# Altium schematic sheet Project_Overview.SchDoc: Project overview
size A4; Date: Not used; ApprovedBy: Not used; CheckedBy: Not used; Author: Not used; CompanyName: STMicroelectronics; DrawnBy: Not used; Engineer: Not used; Organization: Not used; Address1: Not used; Address2: Not used; Address3: Not used; Address4: Not used; DocumentNumber: MB1166; Revision: Not used; SheetNumber: 1; SheetTotal: 16; CurrentTime: Not used; CurrentDate: Not used; Time: Not used; DocumentFullPathAndName: Not used; DocumentName: Not used; ModifiedDate: Not used; ImagePath: Not used; ProjectName: Not used; Application_BuildNumber: Not used
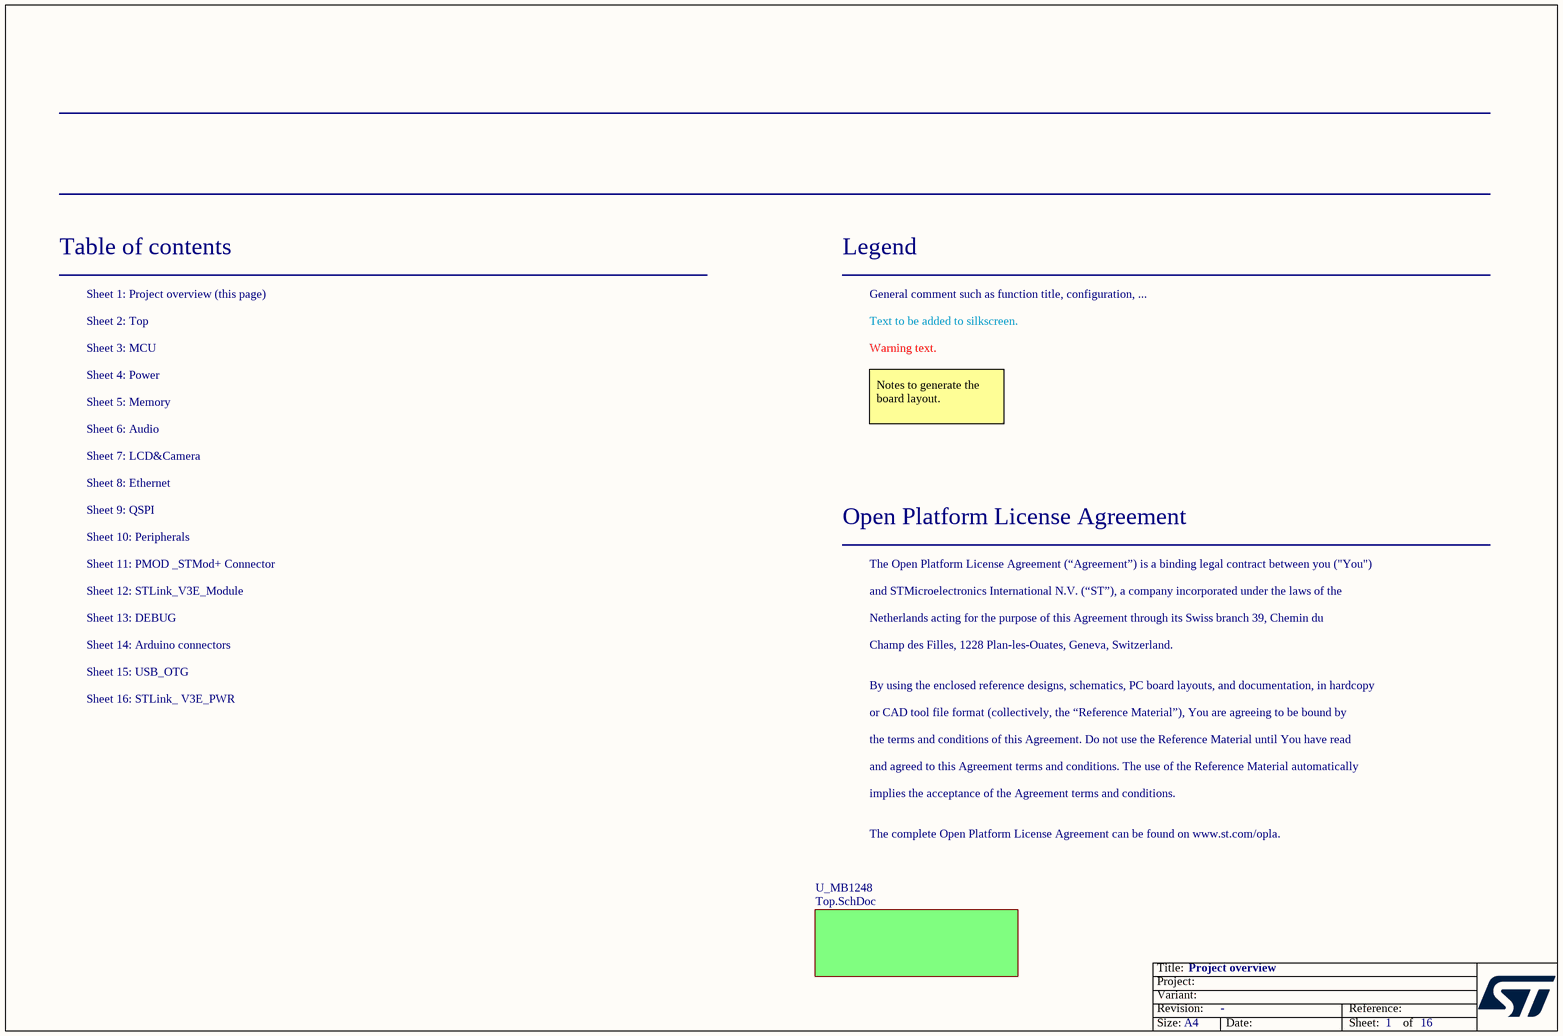
[diagram p0: Project_Overview.SchDoc]

## Sub-sheets
U_MB1248 = Top.SchDoc: no entries

## Notes on the sheet
- Table of contents
- Sheet 1: Project overview (this page)
- Legend
- General comment such as function title, configuration, ...
- Sheet 2: Top
- Sheet 3: MCU
- Sheet 4: Power
- Text to be added to silkscreen.
- Warning text.
- Sheet 5: Memory
- Sheet 6: Audio
- Notes to generate the board layout.
- Sheet 7: LCD&Camera
- Sheet 8: Ethernet
- Sheet 9: QSPI
- Sheet 10: Peripherals
- Sheet 11: PMOD _STMod+ Connector
- Open Platform License Agreement
- The Open Platform License Agreement (“Agreement”) is a binding legal contract between you ("You")
- Sheet 12: STLink_V3E_Module
- Sheet 13: DEBUG
- Sheet 14: Arduino connectors
- and STMicroelectronics International N.V. (“ST”), a company incorporated under the laws of the
- Netherlands acting for the purpose of this Agreement through its Swiss branch 39, Chemin du
- Champ des Filles, 1228 Plan-les-Ouates, Geneva, Switzerland.
- Sheet 15: USB_OTG
- Sheet 16: STLink_ V3E_PWR
- By using the enclosed reference designs, schematics, PC board layouts, and documentation, in hardcopy
- or CAD tool file format (collectively, the “Reference Material”), You are agreeing to be bound by
- the terms and conditions of this Agreement. Do not use the Reference Material until You have read
- and agreed to this Agreement terms and conditions. The use of the Reference Material automatically
- implies the acceptance of the Agreement terms and conditions.
- The complete Open Platform License Agreement can be found on www.st.com/opla.
- Title:
- Project:
- Size:
- Revision:
- Variant:
- A4
- -
- Date:
- Reference:
- Sheet:
- of